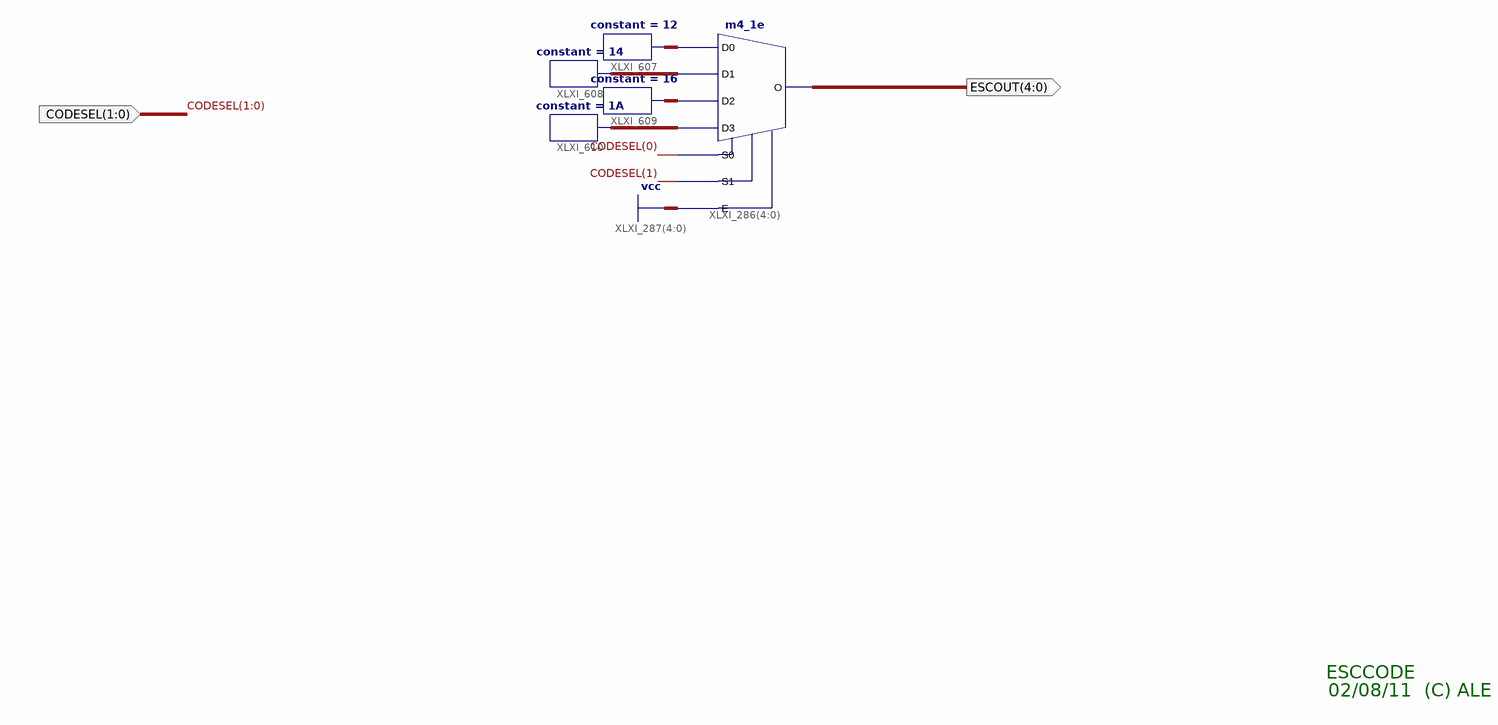
[diagram p0: schematic sheet 1]
// Xilinx ISE schematic EscCode.sch (spartan3e) as structural Verilog: 5 symbols, 2 ports
module EscCode (
  input  [1:0] CODESEL,
  output [4:0] ESCOUT
);

  wire [4:0] XLXN_1595, XLXN_1596, XLXN_1597, XLXN_1598;

  m4_1e XLXI_286[4:0] (
    .D0(XLXN_1597), .D1(XLXN_1596), .D2(XLXN_1598), .D3(XLXN_1595), .E({5{1'b1}}), .S0(CODESEL[0]),
    .S1(CODESEL[1]), .O(ESCOUT));
  constant #(.CValue("1A")) XLXI_610 (.O(XLXN_1595));
  constant #(.CValue("14")) XLXI_608 (.O(XLXN_1596));
  constant #(.CValue("12")) XLXI_607 (.O(XLXN_1597));
  constant #(.CValue("16")) XLXI_609 (.O(XLXN_1598));

  // Notes on the sheet:
  //   ESCCODE
  //   02/08/11  (C) ALE
endmodule
